# EAGLE design PLL schematics (EAGLE 7.6.0)
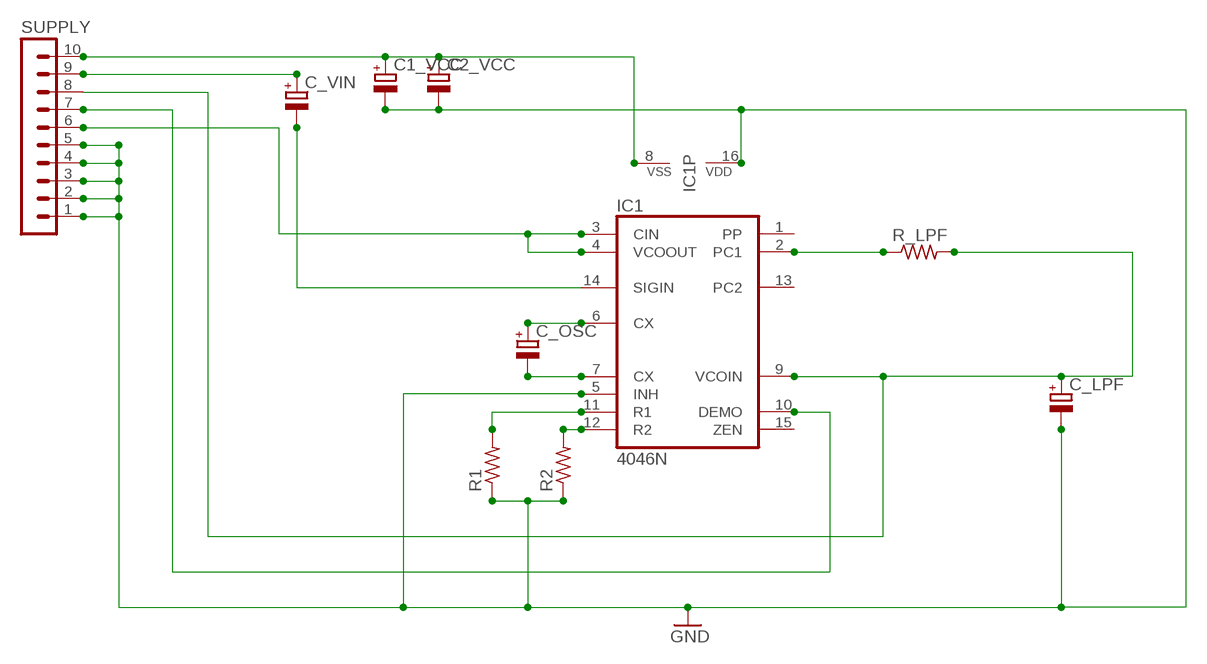
[diagram p0: schematic, sheet 1]

## Parts
C1_VCC  CPOL-EUTAP5-50  [TAP5-50]
C2_VCC  CPOL-EUTAP5-50  [TAP5-50]
C_LPF  CPOL-EUTAP5-50  [TAP5-50]
C_OSC  CPOL-EUTAP5-50  [TAP5-50]
C_VIN  CPOL-EUTAP5-50  [TAP5-50]
IC1  4046N  [DIL16]
R1  R-US_0207/12  [0207/12]
R2  R-US_0207/12  [0207/12]
R_LPF  R-US_0207/12  [0207/12]
SUPPLY  MA10-1  [MA10-1]

## Nets
GND: C1_VCC.- C2_VCC.- C_LPF.- IC1.5(INH) IC1.16(VDD) R1.1 R2.1 SUPPLY.1 SUPPLY.2 SUPPLY.3 SUPPLY.4 SUPPLY.5
N$1: C_OSC.+ IC1.6(CX)
N$2: C_OSC.- IC1.7(CX)
N$3: C1_VCC.+ C2_VCC.+ IC1.8(VSS) SUPPLY.10
N$4: C_VIN.+ SUPPLY.9
N$5: C_VIN.- IC1.14(SIGIN)
N$6: IC1.3(CIN) IC1.4(VCOOUT) SUPPLY.6
N$7: IC1.12(R2) R2.2
N$8: IC1.11(R1) R1.2
N$9: IC1.2(PC1) R_LPF.1
N$10: IC1.10(DEMO) SUPPLY.7
N$11: C_LPF.+ IC1.9(VCOIN) R_LPF.2 SUPPLY.8
Unconnected: IC1.1(PP) IC1.13(PC2) IC1.15(ZEN)

## Library data of the parts
C1_VCC C2_VCC C_LPF C_OSC C_VIN = resistor:CPOL-EU: POLARIZED CAPACITOR, European symbol
IC1 = 40xx:4046: Micropower PLL
R1 R2 R_LPF = resistor:R-US_: RESISTOR, American symbol
SUPPLY = con-lstb:MA10-1: PIN HEADER; OC_FARNELL: unknown; OC_NEWARK: unknown

## Board
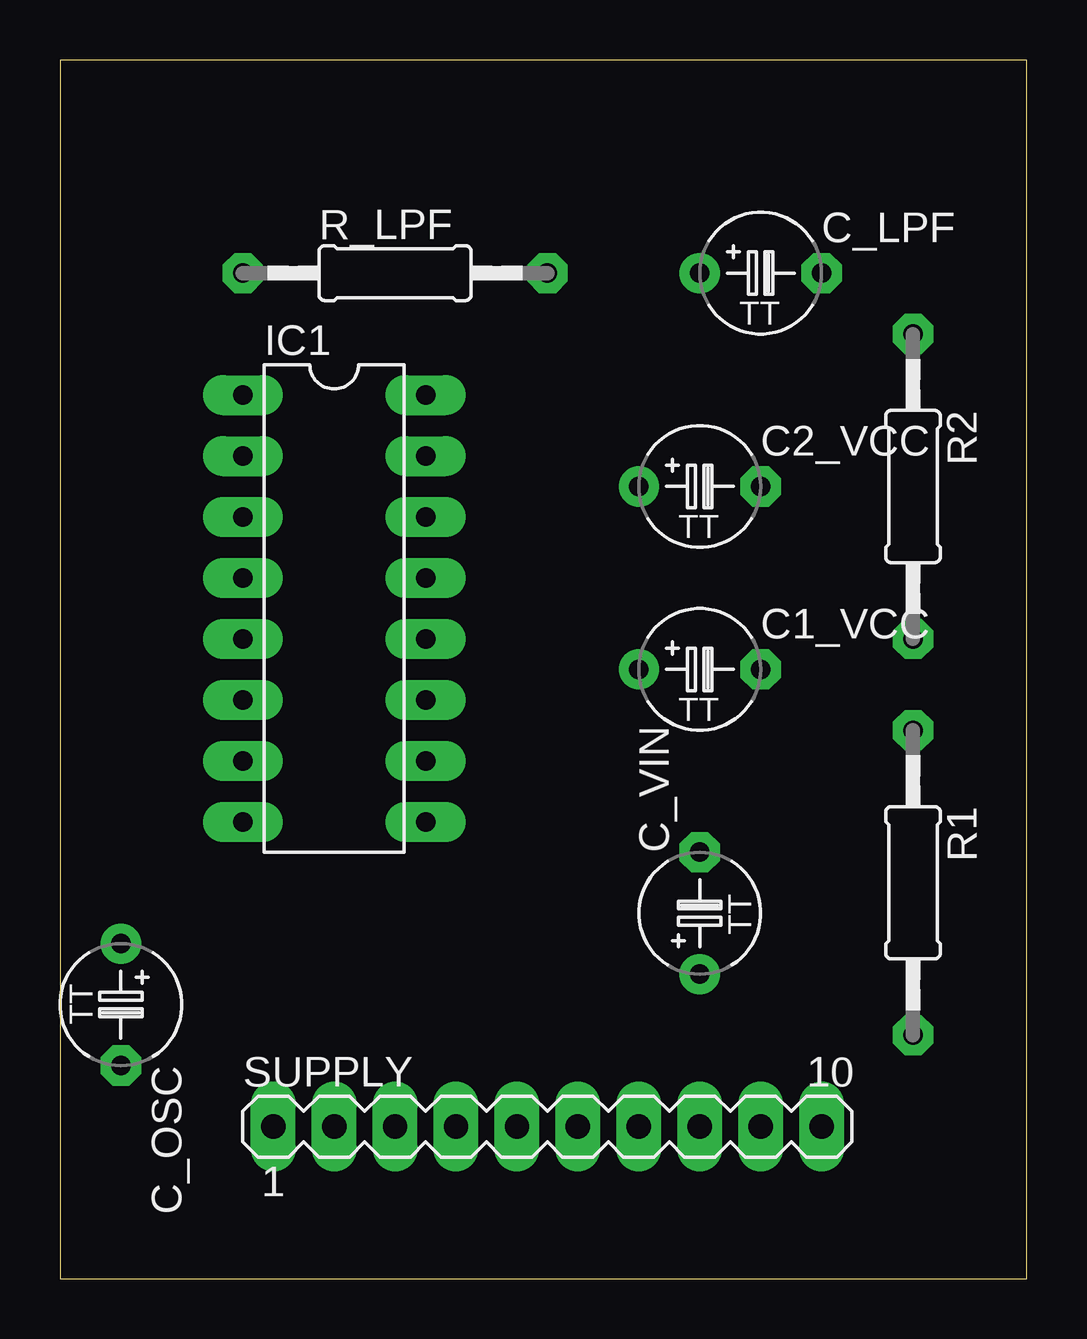
[diagram p1: board, top side]
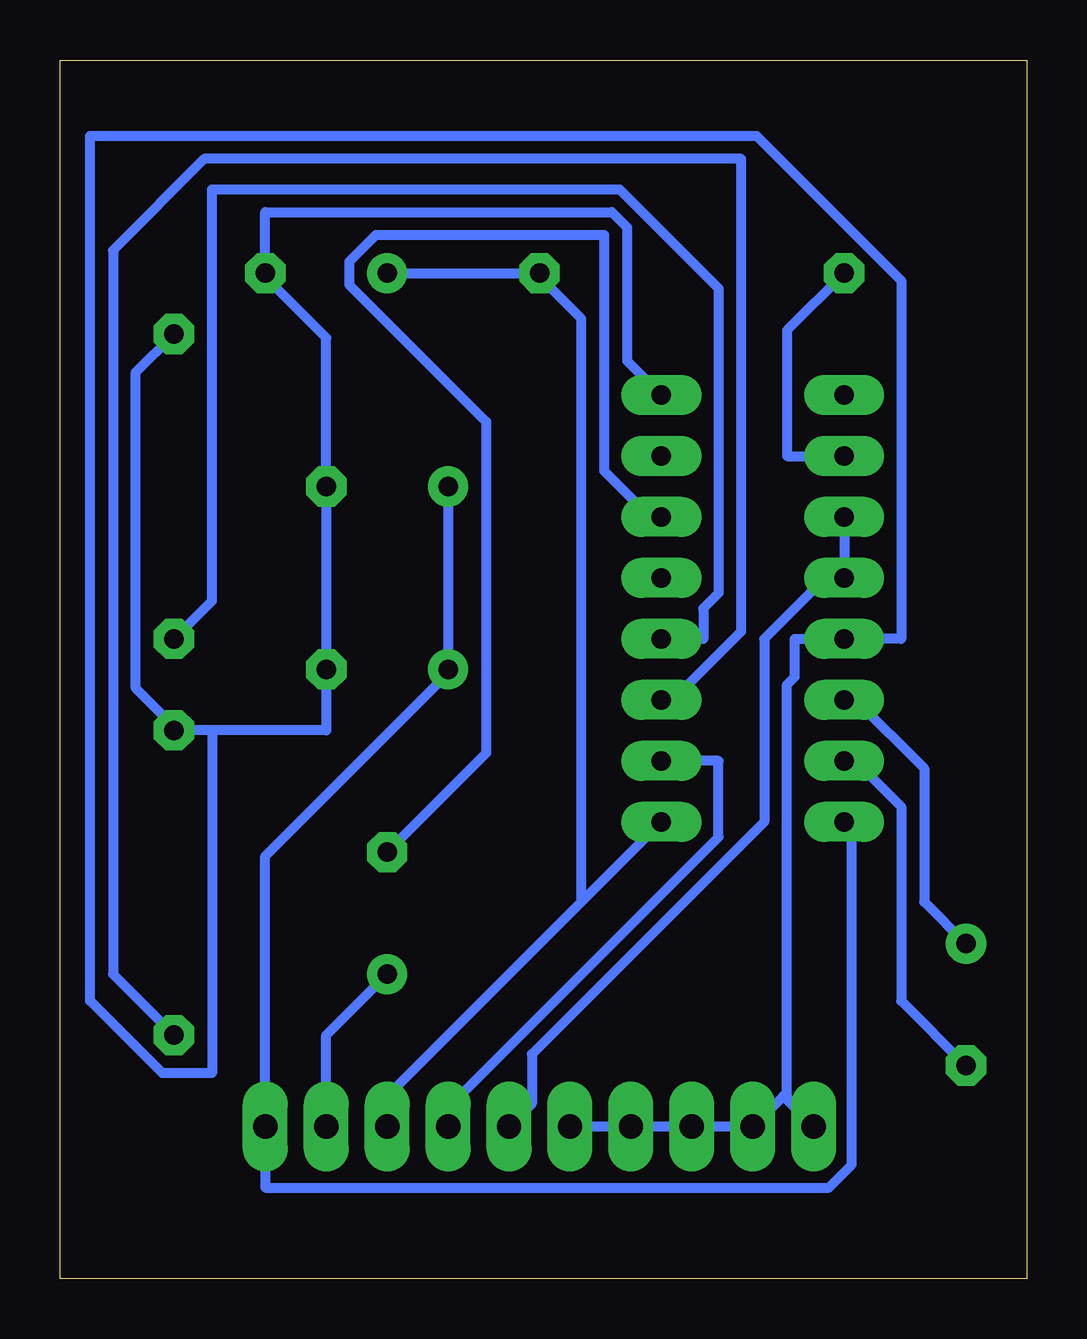
[diagram p2: board, bottom side, seen from below]

Size 40.31 x 50.79 mm. Coordinates in mm from the lower left corner, seen from the top.
Outline: 0,0 40.31,0 40.31,50.79 0,50.79 0,0
Copper layers (1*16): Top 0.035mm / dielectric 1.5mm / Bottom 0.035mm
Design rules "default *": minimum track width 16mil, minimum drill 0.8mm, track to track 16mil, track to pad 16mil, pad to pad 16mil, via to via 16mil, smd to smd 16mil, copper to edge 40mil, drill to drill 8mil, minimum pad ring 17mil, minimum via ring 12mil, stop-mask expansion 4mil, vias tented up to drill 0mil, thermal gap 10mil

### Footprints (pad centres in the part's own frame; a part is rotated, then mirrored left to right if it is on the bottom)
TAP5-50 = drill 0.813: + -2.54,0 | drill 0.813 octagon: - 2.54,0
DIL16 = drill 0.813 long: 1 -8.89,-3.81; 2 -6.35,-3.81; 3 -3.81,-3.81; 4 -1.27,-3.81; 5 1.27,-3.81; 6 3.81,-3.81; 7 6.35,-3.81; 8 8.89,-3.81; 9 8.89,3.81; 10 6.35,3.81; 11 3.81,3.81; 12 1.27,3.81; 13 -1.27,3.81; 14 -3.81,3.81; 15 -6.35,3.81; 16 -8.89,3.81
0207/12 = drill 0.813 octagon: 1 -6.35,0; 2 6.35,0
MA10-1 = drill 1.016 long: 1 -11.43,0; 2 -8.89,0; 3 -6.35,0; 4 -3.81,0; 5 -1.27,0; 6 1.27,0; 7 3.81,0; 8 6.35,0; 9 8.89,0; 10 11.43,0

### Placement (x,y rotation side)
C1_VCC  26.67,25.4 0 top
C2_VCC  26.67,33.02 0 top
C_LPF  29.21,41.91 0 top
C_OSC  2.54,11.43 270 top
C_VIN  26.67,15.24 90 top
IC1  11.43,27.94 270 top
R1  35.56,16.51 270 top
R2  35.56,33.02 270 top
R_LPF  13.97,41.91 0 top
SUPPLY  20.32,6.35 0 top

### Tracks (layer width: path | path; a pad name or v marks a point on that pad's centre or on a via)
GND
  Bottom 0.406: 10,7.62 10,7.46 SUPPLY.1 | 10,7.62 10,24.77 9.68,25.08 9.68,26.67 IC1.5 5.24,26.67 5.24,41.59 11.27,47.62 39.05,47.62 39.05,11.59 36.04,8.57 33.97,8.57 33.97,22.86 | 10,7.62 10.16,7.62 SUPPLY.2 SUPPLY.3 SUPPLY.4 SUPPLY.5 | IC1.16 16.67,38.26 16.67,43.81 17.3,44.45 31.75,44.45 C_LPF.- 31.75,41.75 29.21,39.21 C2_VCC.- C1_VCC.- 29.21,22.86 33.97,22.86 | 33.97,22.86 R1.1 35.56,23.02 37.15,24.61 37.15,37.78 R2.1
N$1
  Bottom 0.406: C_OSC.+ 4.29,15.72 4.29,21.27 7.14,24.13 IC1.6
N$2
  Bottom 0.406: C_OSC.- 5.24,11.59 5.24,19.68 7.14,21.59 IC1.7
N$3
  Bottom 0.406: C2_VCC.+ C1_VCC.+ 24.13,25.24 31.75,17.62 SUPPLY.10 31.75,3.81 8.26,3.81 7.3,4.76 7.3,18.73 IC1.8
N$4
  Bottom 0.406: C_VIN.+ 29.21,10.16 SUPPLY.9
N$5
  Bottom 0.406: C_VIN.- 22.54,21.91 22.54,35.72 28.26,41.43 28.26,42.39 27.15,43.5 17.62,43.5 17.62,33.66 15.72,31.75 IC1.14
N$6
  Bottom 0.406: IC1.3 IC1.4 7.78,29.84 10.95,26.67 10.95,19.05 20.64,9.37 20.64,7.3 SUPPLY.6
N$7
  Bottom 0.406: IC1.12 13.49,26.67 13.49,27.94 12.86,28.57 12.86,41.27 16.99,45.4 33.97,45.4 33.97,28.26 R2.2
N$8
  Bottom 0.406: R1.2 38.1,12.7 38.1,42.86 34.29,46.67 11.91,46.67 11.91,26.99 14.76,24.13 IC1.11
N$9
  Bottom 0.406: IC1.2 10,34.29 10,39.53 R_LPF.1
N$10
  Bottom 0.406: IC1.10 12.86,21.59 12.86,18.41 24.13,7.14 SUPPLY.7
N$11
  Bottom 0.406: C_LPF.+ R_LPF.2 20.32,41.75 18.57,40.01 18.57,15.88 18.49,15.8 | 18.49,15.8 26.67,7.62 SUPPLY.8 | 18.49,15.8 IC1.9